# Altium schematic sheet Sheet_1_2021-12-20.schdoc
size 48 x 29 mm
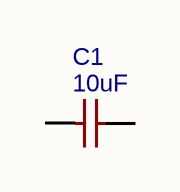
[diagram p0: Sheet_1_2021-12-20.schdoc]

## Parts
C1  10uF  [C1206]

## Nets

Not connected (* = marked no-connect by the designer): C1 1 2

## Library data of the parts
C1 = 10uF: BOM_Manufacturer Part: CL31A106KBHNNNE; BOM_Manufacturer: SAMSUNG; nameAlias: Capacitance; BOM_Supplier: LCSC; BOM_Supplier Part: C13585; BOM_JLCPCB Part Class: Basic Part; spicePre: C; spiceSymbolName: CL31A106KBHNNNE